# Altium schematic sheet STM32F405.SchDoc
size A4
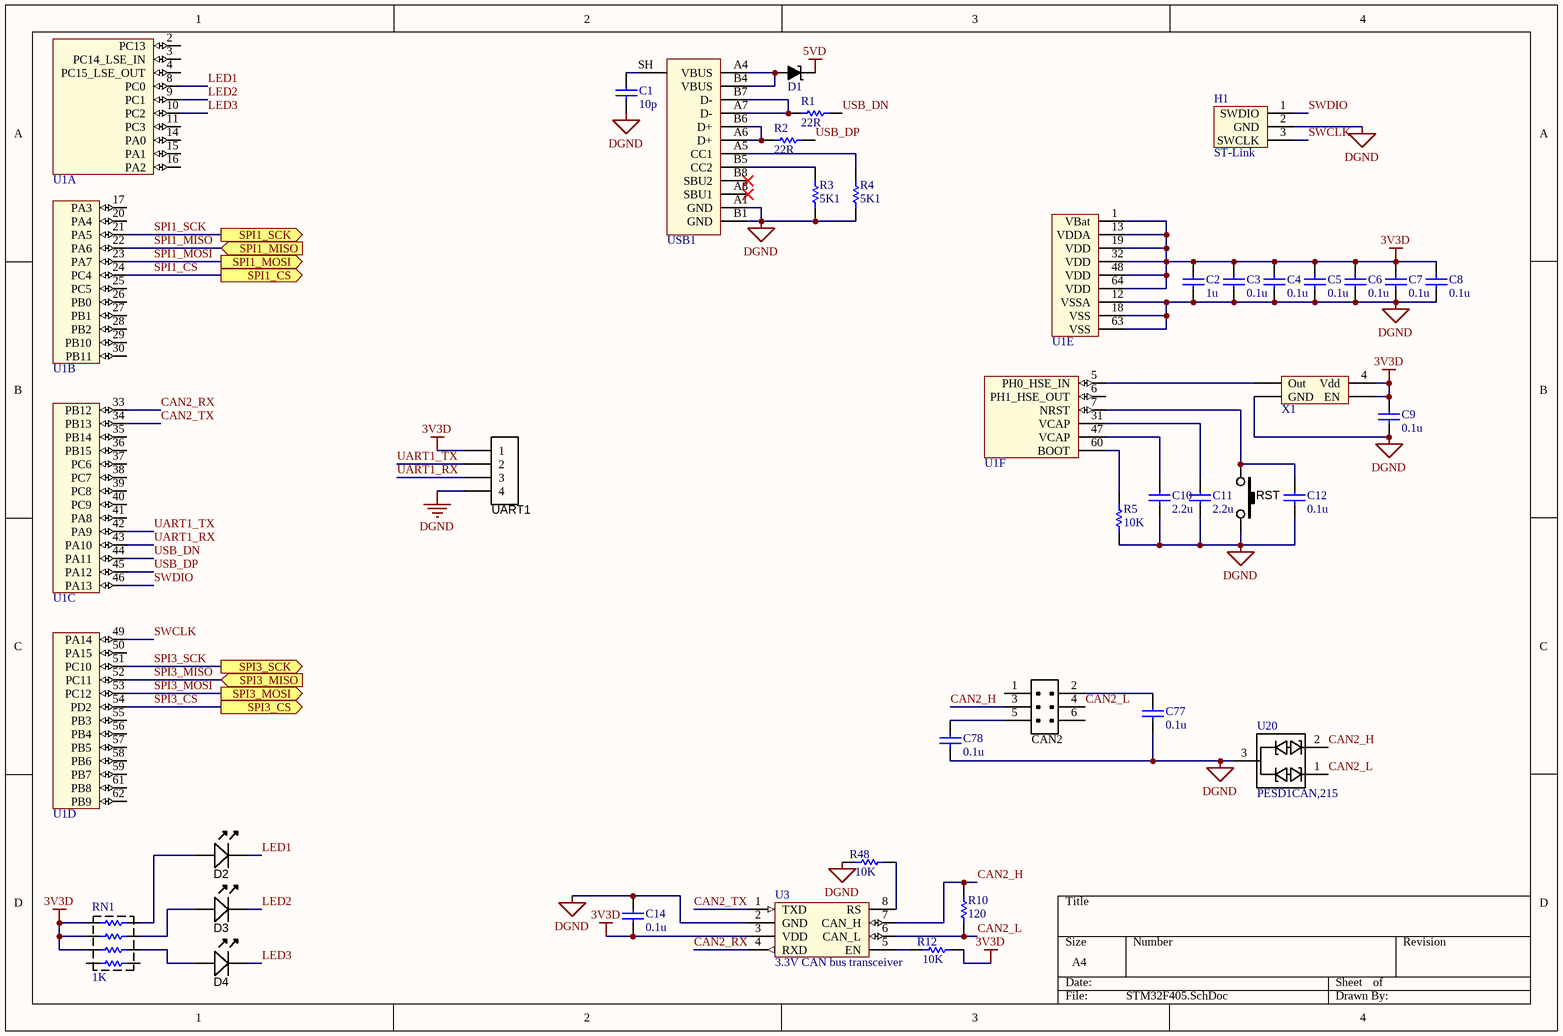
[diagram p0: STM32F405.SchDoc]

## Parts
C1  value 10p  [CAPC1608X90N]  (hidden comment: Cap)
C2  value 1u  [CAPC1608X90N]  (hidden comment: Cap)
C3  value 0.1u  [CAPC1608X90N]  (hidden comment: Cap)
C4  value 0.1u  [CAPC1608X90N]  (hidden comment: Cap)
C5  value 0.1u  [CAPC1608X90N]  (hidden comment: Cap)
C6  value 0.1u  [CAPC1608X90N]  (hidden comment: Cap)
C7  value 0.1u  [CAPC1608X90N]  (hidden comment: Cap)
C8  value 0.1u  [CAPC1608X90N]  (hidden comment: Cap)
C9  value 0.1u  [CAPC1608X90N]  (hidden comment: Cap)
C10  value 2.2u  [CAPC1608X90N]  (hidden comment: Cap)
C11  value 2.2u  [CAPC1608X90N]  (hidden comment: Cap)
C12  value 0.1u  [CAPC1608X90N]  (hidden comment: Cap)
C14  value 0.1u  [CAPC1608X90N]  (hidden comment: Cap)
C77  value 0.1u  [CAPC1608X90N]  (hidden comment: Cap)
C78  value 0.1u  [CAPC1608X90N]  (hidden comment: Cap)
CAN2  Header, 2x3-pin  [HDR2X3_2.54MMP_RA]  (value not drawn)
D1  diode  [DIODE_3216_70N]  (value not drawn)
D2  LED_Green_GullWing  [LED-0805-A]  (value not drawn)
D3  LED_Green_GullWing  [LED-0805-A]  (value not drawn)
D4  LED_Green_GullWing  [LED-0805-A]  (value not drawn)
H1  ST-Link  [ST-Link]
R1  value 22R  [RESC1608X55N]  (hidden comment: Res1)
R2  value 22R  [RESC1608X55N]  (hidden comment: Res1)
R3  value 5K1  [RESC1608X55N]  (hidden comment: Res1)
R4  value 5K1  [RESC1608X55N]  (hidden comment: Res1)
R5  value 10K  [RESC1608X55N]  (hidden comment: Res1)
R10  value 120  [RESC1608X55N]  (hidden comment: Res1)
R12  value 10K  [RESC1608X55N]  (hidden comment: Res1)
R48  value 10K  [RESC1608X55N]  (hidden comment: Res1)
RN1  value 1K  [RESCAXS50P160X320X70-8N]  (hidden comment: resistor network)
RST  SW_THT_PB_4.3mm  [TACT_SWT-SMD-4.4]  (value not drawn)
U1  STM32F405RE  [LQFP64]  (value not drawn)  (parts A,B,C,D,E,F of 6)
U3  3.3V CAN bus transceiver  [SOIC127P600X175-8AN]
U20  PESD1CAN,215  [SOT23-3]
UART1  Programmer  [HDR1X4_2.54MMP]  (value not drawn)  (no BOM)
USB1  USB type C connector  [TYPE-C-31-M-12]  (value not drawn)
X1  ASE-8.000MHZ-LC-T  [ASE Series]  (value not drawn)

## Ports
SPI1_CS (out), SPI1_MISO (in), SPI1_MOSI (out), SPI1_SCK (out), SPI3_CS (out), SPI3_MISO (in), SPI3_MOSI (out), SPI3_SCK (out)

## Nets
3V3D: C2.2 C3.2 C4.2 C5.2 C6.2 C7.2 C8.2 C9.2 C14.1 R12.1 RN1.1 RN1.2 RN1.3 U1.1(VBat) U1.13(VDDA) U1.19(VDD) U1.32(VDD) U1.48(VDD) U1.64(VDD) U3.3(VDD) UART1.1 X1.1(EN) X1.4(Vdd)
5VD: D1.K(Cathode)
DGND: C1.1 C2.1 C3.1 C4.1 C5.1 C6.1 C7.1 C8.1 C9.1 C10.1 C11.1 C12.1 C14.2 C77.2 C78.1 H1.2(GND) R3.1 R4.1 R5.1 R48.2 RST.2 U1.12(VSSA) U1.18(VSS) U1.63(VSS) U3.2(GND) U20.3 UART1.4 USB1.A1(GND) USB1.B1(GND) X1.2(GND)
CAN2_H: CAN2.3 R10.2 U3.7(CAN_H) U20.2
CAN2_L: CAN2.4 R10.1 U3.6(CAN_L) U20.1
CAN2_RX: U1.33(PB12) U3.4(RXD)
CAN2_TX: U1.34(PB13) U3.1(TXD)
LED1: D2.K U1.8(PC0)
LED2: D3.K U1.9(PC1)
LED3: D4.K U1.10(PC2)
SPI1_CS: U1.24(PC4) ; port SPI1_CS
SPI1_MISO: U1.22(PA6) ; port SPI1_MISO
SPI1_MOSI: U1.23(PA7) ; port SPI1_MOSI
SPI1_SCK: U1.21(PA5) ; port SPI1_SCK
SPI3_CS: U1.54(PD2) ; port SPI3_CS
SPI3_MISO: U1.52(PC11) ; port SPI3_MISO
SPI3_MOSI: U1.53(PC12) ; port SPI3_MOSI
SPI3_SCK: U1.51(PC10) ; port SPI3_SCK
SWCLK: H1.3(SWCLK) U1.49(PA14)
SWDIO: H1.1(SWDIO) U1.46(PA13)
UART1_RX: U1.43(PA10) UART1.3
UART1_TX: U1.42(PA9) UART1.2
USB_DN: R1.2 U1.44(PA11)
USB_DP: R2.2 U1.45(PA12)
NetC1_2: C1.2 USB1.SH
NetC10_2: C10.2 U1.47(VCAP)
NetC11_2: C11.2 U1.31(VCAP)
NetC12_2: C12.2 RST.1 U1.7(NRST)
NetC77_1: C77.1 CAN2.2
NetC78_2: C78.2 CAN2.5
NetD1_A: D1.A(Anode) USB1.A4(VBUS) USB1.B4(VBUS)
NetD2_A: D2.A RN1.8
NetD3_A: D3.A RN1.7
NetD4_A: D4.A RN1.6
NetR1_1: R1.1 USB1.A7(D-) USB1.B7(D-)
NetR2_1: R2.1 USB1.A6(D+) USB1.B6(D+)
NetR3_2: R3.2 USB1.B5(CC2)
NetR4_2: R4.2 USB1.A5(CC1)
NetR5_2: R5.2 U1.60(BOOT)
NetR12_2: R12.2 U3.5(EN)
NetR48_1: R48.1 U3.8(RS)
NetU1_5: U1.5(PH0_HSE_IN) X1.3(Out)

Not connected (* = marked no-connect by the designer): CAN2 1 6; RN1 4 5; U1 2(PC13) 3(PC14_LSE_IN) 4(PC15_LSE_OUT) 6(PH1_HSE_OUT) 11(PC3) 14(PA0) 15(PA1) 16(PA2) 17(PA3) 20(PA4) 25(PC5) 26(PB0) 27(PB1) 28(PB2) 29(PB10) 30(PB11) 35(PB14) 36(PB15) 37(PC6) 38(PC7) 39(PC8) 40(PC9) 41(PA8) 50(PA15) 55(PB3) 56(PB4) 57(PB5) 58(PB6) 59(PB7) 61(PB8) 62(PB9); USB1 A8(SBU1)* B8(SBU2)*

## Library data of the parts
C1-C12 C14 C77 C78 = Cap: Capacitor; Published: 8-Jun-2000; LatestRevisionDate: 17-Jul-2002; LatestRevisionNote: Re-released for DXP Platform.; PackageReference: RAD-0.3; Publisher: Altium Limited; PackageDescription: Radial Cap, Thru-Hole; 2 Leads; 0.3 in Pin Spacing
CAN2 = Header_2x3P
D1 = SD1206S040S2R0: 40V 2A; ComponentLink1Description: mouser; ComponentLink1URL: https://www.mouser.hk/ProductDetail/AVX/SD1206S040S2R0?qs=jCA%252BPfw4LHbfEJl0sZ31oA%3D%3D
D2-D4 = LED_Green_GullWing: LED Gull-wing SMD High-intensity Green 450mcd 574nm; Manufacturer 1: Ligitek; Manufacturer Part Number 1: L8UG9033/TR1; Ratings: 450 mcd; 574 nm; Material: AlGaInP; SCDType: source; Package / Case: 4.6mm Gull-Wing; Color: Green
H1 = ST-Link: ST-Link header with silkscreen
R1-R5 R10 R12 R48 = Res1: Resistor; Published: 8-Jun-2000; LatestRevisionDate: 17-Jul-2002; LatestRevisionNote: Re-released for DXP Platform.; PackageReference: AXIAL-0.3; Publisher: Altium Limited; PackageDescription: Axial Device, Thru-Hole; 2 Leads; 0.3 in Pin Spacing
RN1 = RES_NET
RST = SW_THT_PB_4.3mm: Switch, tact, 4.3mm stem; Manufacturer 1: Bond-Tact; Manufacturer Part Number 1: TS-1143-WP-300; SCDType: spec; Function: Speed; Package / Case: 6.5x6.5mm; 4.3mm stem; Material: Brass/Nylon/Ag plating
U1 = STM32F405RE: STM32F405RE 64 pin package, Cortex M4 core with up to
U3 = SN65HVD234-Q1: 3.3V CAN bus transceiver up to 1Mbps
U20 = PESD1CAN,215: ESD protection for CAN bus. Clamp voltage is 40V
UART1 = Header4P: Header 4-pin
USB1 = USB_Type_C: ComponentLink1Description: Datasheet; ComponentLink1URL: https://lcsc.com/product-detail/USB-Type-C_Korean-Hroparts-Elec-TYPE-C-31-M-12_C165948.html
X1 = ASE-8.000MHZ-LC-T: 8MHz; ComponentLink1Description: Datasheet; ComponentLink1URL: https://www.mouser.hk/ProductDetail/ABRACON/ASE-8000MHZ-LC-T?qs=ShQ8XZQtgRsRMJ3lmGY0Sw%3D%3D